# Altium schematic sheet Transimpedance.SchDoc
size A4; SheetNumber: 6; SheetTotal: 6
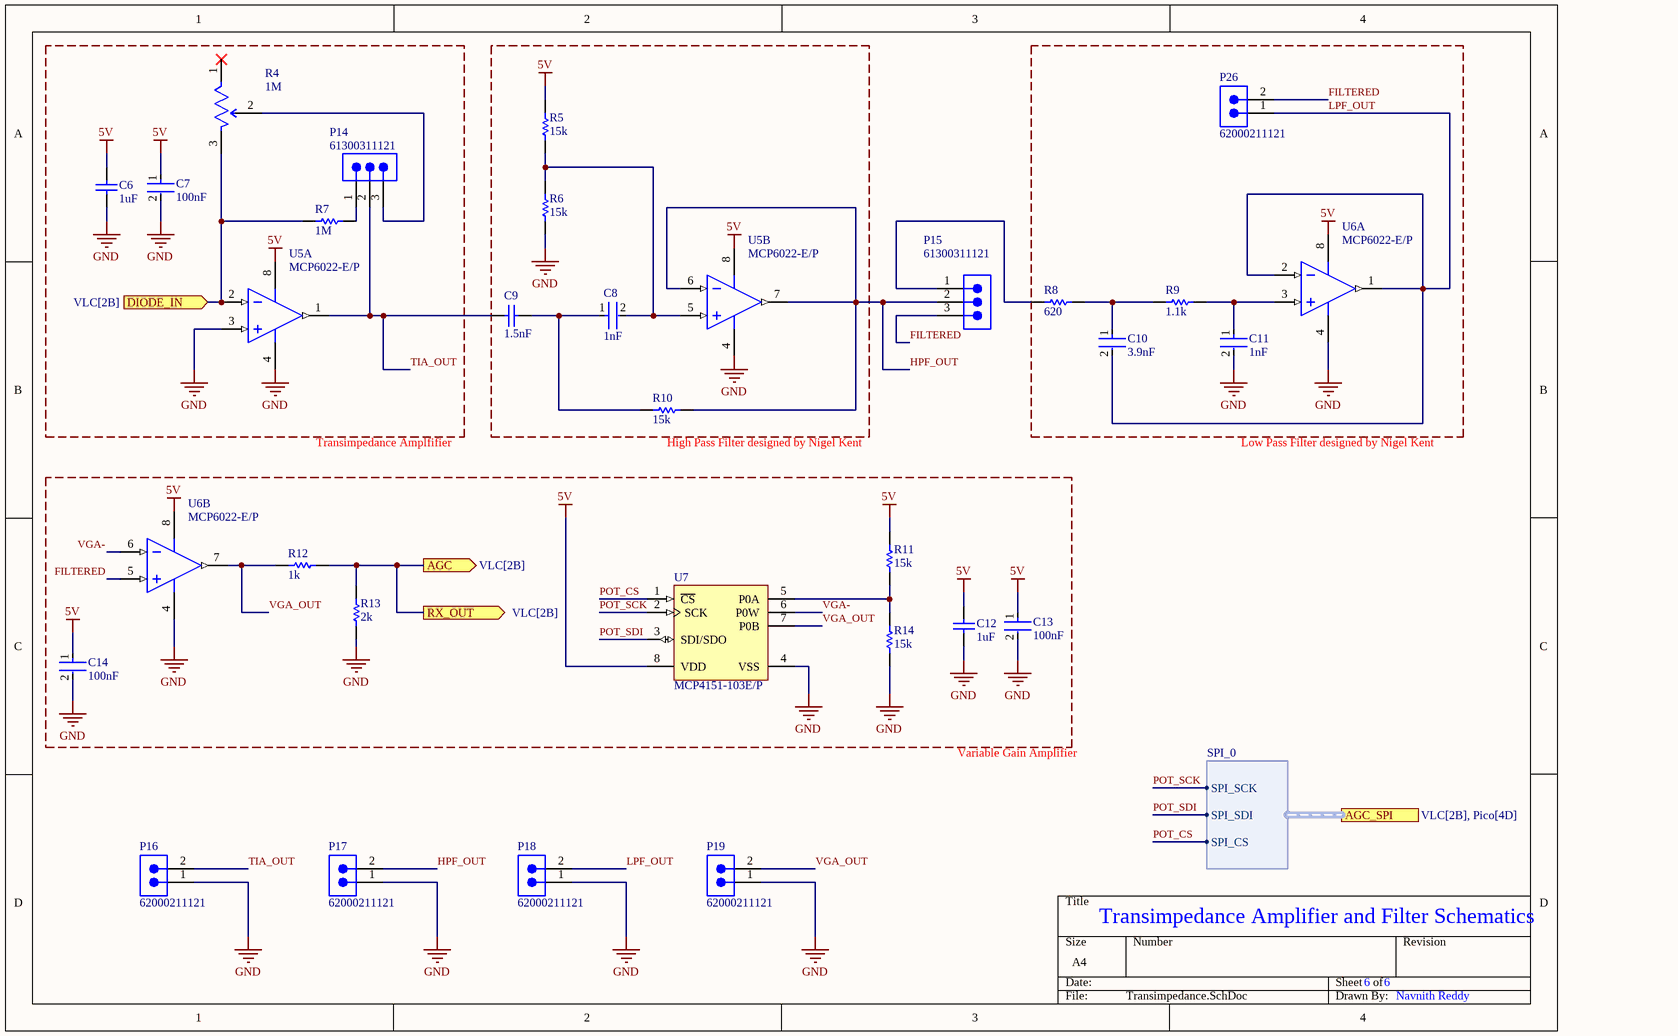
[diagram p0: Transimpedance.SchDoc]

## Parts
C6  1uF  [CAPC2013X145X50LL20T25]
C7  100nF  [FP-C0805C-DN-MFG]
C8  1nF  [FP-0805-L_2_01_0_2-W_1_25-IPC_C]
C9  1.5nF  [CAPC2013X94X50ML20T25]
C10  3.9nF  [FP-C0805C-DN-MFG]
C11  1nF  [FP-0805-L_2_01_0_2-W_1_25-IPC_C]
C12  1uF  [CAPC2013X145X50LL20T25]
C13  100nF  [FP-C0805C-DN-MFG]
C14  100nF  [FP-C0805C-DN-MFG]
P14  61300311121  [61300311121]
P15  61300311121  [61300311121]
P16  62000211121  [62000211121]
P17  62000211121  [62000211121]
P18  62000211121  [62000211121]
P19  62000211121  [62000211121]
P26  62000211121  [62000211121]
R4  1M  [FP-3296W-MFG]
R5  15k  [RESC2013X55X40NL15T20]
R6  15k  [RESC2013X55X40NL15T20]
R7  1M  [RESC2013X60X40LL20T25]
R8  620  [RESC2013X70X40LL20T20]
R9  1.1k  [RESC2013X50X30LL20T20]
R10  15k  [RESC2013X55X40NL15T20]
R11  15k  [RESC2013X55X40NL15T20]
R12  1k  [RESC2013X70X40ML20T20]
R13  2k  [RESC2013X70X40ML20T20]
R14  15k  [RESC2013X55X40NL15T20]
U5  MCP6022-E/P  [PDIP300-P8]  (parts A,B of 2)
U6  MCP6022-E/P  [PDIP300-P8]  (parts A,B of 2)
U7  MCP4151-103E/P  [PDIP300-P8]

## Ports
AGC (out, see VLC[2B]), AGC_SPI (harness SPI_0, see VLC[2B], Pico[4D]), DIODE_IN (in, see VLC[2B]), RX_OUT (out, see VLC[2B])

## Harnesses
SPI_0: SPI_SCK, SPI_SDI, SPI_CS

## Nets
5V: C6.2 C7.1 C12.2 C13.1 C14.1 R5.2 R11.2 U5.8(VDD) U6.8(VDD) U7.8(VDD)
GND: C6.1 C7.2 C11.2 C12.1 C13.2 C14.2 P16.1 P17.1 P18.1 P19.1 R6.1 R13.1 R14.1 U5.3(VINA+) U5.4(VSS) U6.4(VSS) U7.4(VSS)
AGC: R12.2 R13.2 ; port AGC, port RX_OUT
DIODE_IN: R4.3(CW) R7.1 U5.2(VINA-) ; port DIODE_IN
FILTERED: P15.3 P26.2 U6.5(VINB+)
HPF_OUT: P15.2 P17.2 R10.2 U5.6(VINB-) U5.7(VOUTB)
LPF_OUT: C10.2 P18.2 P26.1 U6.1(VOUTA) U6.2(VINA-)
POT_CS: U7.1(~{CS}) ; port AGC_SPI.SPI_CS
POT_SCK: U7.2(SCK) ; port AGC_SPI.SPI_SCK
POT_SDI: U7.3(SDI/SDO) ; port AGC_SPI.SPI_SDI
TIA_OUT: C9.1 P14.2 P16.2 U5.1(VOUTA)
VGA-: U6.6(VINB-) U7.6(P0W)
VGA_OUT: P19.2 R12.1 U6.7(VOUTB) U7.7(P0B)
NetC8_1: C8.1 C9.2 R10.1
NetC8_2: C8.2 R5.1 R6.2 U5.5(VINB+)
NetC10_1: C10.1 R8.2 R9.1
NetC11_1: C11.1 R9.2 U6.3(VINA+)
NetP14_1: P14.1 R7.2
NetP14_3: P14.3 R4.2(WIPER)
NetP15_1: P15.1 R8.1
NetR11_1: R11.1 R14.2 U7.5(P0A)

Not connected (* = marked no-connect by the designer): R4 1(CCW)*

## Notes on the sheet
- Transimpedance Amplfifier
- (near R10) High Pass Filter designed by Nigel Kent
- Low Pass Filter designed by Nigel Kent
- Variable Gain Amplifier
- Transimpedance Amplifier and Filter Schematics
- 6
- Navnith Reddy

## Library data of the parts
C6 C12 = CMP-1036-04746-2: Manufacturer: Kemet; Part Number: C0805C105K4PACTU
C7 C13 C14 = CMP-2007-00274-2: CAP CER 0.1UF 16V X7R 0805; Manufacturer Part Number: C0805C104K4RACTU; Manufacturer: KEMET; Material: Ceramic; Tolerance: 0.1; Capacitance: 0.10 μF; Value: 0.10 μF; Temperature Coefficient: 30ppm/°C; Device Class L3: Ceramic Capacitors; RoHS: TRUE; Octopart: https://octopart.com/c0805c104k4ractu-kemet-92155; ComponentLink2Description: Datasheet; ComponentLink2URL: https://content.kemet.com/datasheets/KEM_C1003_C0G_SMD.pdf; Temperature Range High: +125°C; Category: Cap; Lead Free: Yes; Digikey Description: CAP CER 0.1UF 16V X7R 0805; Automotive: No; Temperature Range Low: -55°C; Voltage Rating: 16 V; Package: C0805C-DN; Ipc Land Pattern Name: CAPC200125X78; Height: 0.88mm; Device Class L1: Passive Components; Temperature: -55°C to +125°C; Mouser Description: Multilayer Ceramic Capacitors MLCC - SMD/SMT 16volts 0.1uF X7R 10%; Device Class L2: Capacitors; Temperature Characteristic: X7R
C8 C11 = CMP-1036-02979-3: General Purpose Ceramic Capacitor, 0805, 1nF, 10%, X7R, 0.15, 50V; Dissipation Factor: 2.5%; Insulation Resistance: 100GR; Radiation Hardening: No; Case Code (Imperial): 0805; Packaging: Tape and Reel; Height: 0.94mm; Number of Pins: 2; REACH SVHC: No SVHC; Case Code (Metric): 2012; Voltage: 50V; Max Operating Temperature: 125°C; Tolerance: 10%; Voltage Rating: 50V; Depth: 1.25mm; Voltage Rating (DC): 50V; Thickness: 0.037inch; Termination: SMD/SMT; Package Quantity: 1; RoHS Compliant: Yes; Mount: Surface Mount; Dielectric: X7R; Length: 2.01mm; Contact Plating: Tin; Lead Free: Lead Free; Case/Package: 0805; Width: 1.25mm; Capacitance: 1nF; Dielectric Material: Ceramic; Min Operating Temperature: -55°C
C9 = CMP-2007-04179-1: Manufacturer: AVX Interconnect / Elco; Part Number: 08051C152KAT2A
C10 = CMP-2007-03730-2: CAP CER 3900PF 200V C0G/NP0 0805; Manufacturer Part Number: C0805C392J2GACAUTO; Manufacturer: KEMET; Temperature Characteristic: C0G; Value: 3,900 pF; Material: Ceramic; Tolerance: 0.05; Temperature Coefficient: 30ppm/°C; Category: Cap; Lead Free: Yes; Device Class L1: Passive Components; Temperature Range Low: -55°C; Temperature Range High: +125°C; Height: 0.88mm; Voltage Rating: 200 V; Device Class L2: Capacitors; Octopart: https://octopart.com/c0805c392j2gacauto-kemet-46733246; Capacitance: 3,900 pF; Temperature: -55°C to +125°C; Ipc Land Pattern Name: CAPC200125X78; Automotive: No; Digikey Description: CAP CER 3900PF 200V C0G/NP0 0805; ComponentLink2URL: https://content.kemet.com/datasheets/KEM_C1003_C0G_SMD.pdf; Device Class L3: Ceramic Capacitors; Package: C0805C-DN; RoHS: TRUE; ComponentLink2Description: Datasheet
P14 P15 = CMP-1502-01062-2: NexarPartId: 32855521; Voltage Rating: 250V; Current Rating: 3A; Connector Type: Male Pin; Number of Positions: 3; Gender: Male; Contact Resistance: 20mΩ; Pitch: 2.54mm; Max Operating Temperature: 105°C; Lead Pitch: 2.54mm; Lead Free: Lead Free; Contact Mating Length: 5.9944mm; Contact Material: Copper; Number of Pins: 3; Orientation: Vertical; Height: 8.94mm; Packaging: Bulk; Min Operating Temperature: -40°C; Mount: Through Hole; RoHS: Compliant; Number of Contacts: 3; Operating Supply Voltage: 250V; Termination: Solder; Number of Rows: 1; Contact Plating: Gold; Color: Black; REACH SVHC: Unknown
P16-P19 P26 = CMP-1502-00956-3: NexarPartId: 61924778; Number of Contacts: 2; Voltage Rating: 200V; Gender: Male; Contact Resistance: 20mΩ; Current Rating: 2A; Lead Pitch: 2mm; Max Operating Temperature: 105°C; Contact Material: Gold; Number of Rows: 1; Operating Supply Voltage: 200V; Number of Pins: 2; Orientation: Vertical; Min Operating Temperature: -40°C; Height: 6.35mm; RoHS: Non-Compliant
R4 = CMP-07234-000048-1: TRIMMER 200K OHM 0.5W PC PIN TOP; Resistance Tolerance: 10%; Number of Turns: 25; Temperature Coefficient: 100ppm/°C; Power Rating: 500mW; Resistance: 200kR; Resistor Type: Cermet; Color: Blue; Radiation Hardening: No; RoHS Compliant: Yes; Taper: Linear; Technology: CERMET; Mount: Panel; Packaging: Rail/Tube; Lead Free: Lead Free; Tolerance: 10%; Min Operating Temperature: -55°C; Depth: 4.83mm; Length: 9.53mm; Width: 9.53mm; REACH SVHC: No SVHC; Package Quantity: 50; Height: 0.395inch; Max Power Dissipation: 500mW; Max Operating Temperature: 125°C; Military Standard: Not; Termination: Pin; Contact Plating: Tin; Series: 3296; Weight: 0.03oz
R5 R6 R10 R11 R14 = CMP-2001-04735-1: Part Number: TNPW080515K0BEEA; Manufacturer: Vishay Dale
R7 = CMP-2001-00584-1: Part Number: ERA-6AEB105V; Manufacturer: Panasonic
R8 = CMP-2001-00436-1: Manufacturer: Panasonic; Part Number: ERJ-6GEYJ621V
R9 = CMP-1013-00514-2: Part Number: CRCW08051K10FKTA; Manufacturer: Vishay Dale
R12 = CMP-2001-04375-5: Chip Resistor, 1 KOhm, +/- 1%, 0.125 W, -55 to 155 degC, 0805 (2012 Metric), RoHS, Tape and Reel; Manufacturer: Panasonic; Voltage Rating: 150 V; ComponentLink1URL: http://www.panasonic.com/; ComponentLink2Description: Datasheet; REACH SVHC: Yes; ComponentLink1Description: Manufacturer URL; Length: 2 mm; Height: 0.6 mm; Package Quantity: 1; PackageDescription: 2-Pin Surface Mount Device, Body 2 x 1.25 mm; Packaging: Cut Tape; PackageReference: 0805; Max Operating Temperature: 155 degC; Mounting Technology: Surface Mount; ComponentLink2URL: http://industrial.panasonic.com/cdbs/www-data/pdf/RDA0000/AOA0000C86.pdf; DatasheetVersion: 04/2015; Min Operating Temperature: -55 degC; RoHSCompliant: true; Mount: Surface Mount
R13 = CMP-2001-00370-1: Part Number: ERJ-6GEYJ202V; Manufacturer: Panasonic
U5 U6 = CMP-0187-00090-3: None; Max Supply Voltage: 5.5V; Voltage Gain: 110dB; Input Bias Current: 5nA; Bandwidth: 10MHz; Number of Elements: 2; Min Supply Voltage: 2.5V; Input Offset Voltage-Max: 500uV; Power Supply Rejection Ratio (PSRR): 74dB; Nominal Supply Current: 1mA; Input Offset Voltage (Vos): 250uV; Amplifier Type: GENERAL PURPOSE; Common Mode Rejection Ratio: 70dB; Slew Rate-Nom: 7V/µs; Output Current: 22mA; Max Operating Temperature: 125°C; REACH SVHC: No SVHC; Height: 0.195inch; Length: 0.4inch; Min Operating Temperature: -40°C; Mount: Through Hole; Number of Amplifiers: 2; Harmonic Distortion: 0.00053%; Gain Bandwidth Product: 10MHz; RoHS Compliant: Yes; Unity Gain Bandwidth Product: 10MHz; Number of Channels: 2; Radiation Hardening: No; Technology: CMOS; Supply Current: 1mA; Package Quantity: 60; Lead Free: Lead Free; Width: 0.28inch; Slew Rate: 7V/µs; Case/Package: PDIP; Packaging: Rail/Tube; Number of Pins: 8; Number of Circuits: 2
U7 = CMP-0188-00257-2: 7/8-Bit Single/Dual SPI Digital POT with Volatile Memory, 8-Pin PDIP, Extended Temperature; RevisionNote: URLs added.; PackageReference: PDIP300-P8; ComponentLink1Description: Manufacturer URL; ComponentLink3URL: http://www.microchip.com/stellent/groups/techpub_sg/documents/packagingspec/en012702.pdf; PackageDescription: 8-Lead Plastic Dual In-Line (P) - 300 mil Body [PDIP]; ComponentLink2Description: Datasheet; Code_JEDEC: MS-001; ComponentLink2URL: http://ww1.microchip.com/downloads/en/DeviceDoc/22060b.pdf; DatasheetVersion: revB, Dec-2008; ComponentLink1URL: http://www.microchip.com/; ComponentLink3Description: Package Specification; PackageVersion: revBB, Aug-2009